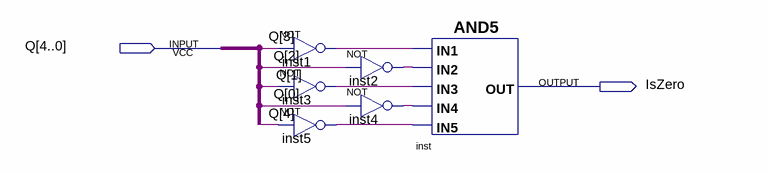
[diagram p0: schematic sheet]
// Quartus schematic IsZero.bdf as structural Verilog: 6 symbols, 2 pins
module IsZero (
  input  [4:0] Q,
  output IsZero
);

  wire inst1_out, inst2_out, inst3_out, inst4_out, inst5_out;

  not inst1 (inst1_out, Q[3]);
  not inst3 (inst3_out, Q[1]);
  not inst5 (inst5_out, Q[4]);
  not inst2 (inst2_out, Q[2]);
  not inst4 (inst4_out, Q[0]);
  and inst (IsZero, inst1_out, inst2_out, inst3_out, inst4_out, inst5_out);
endmodule
